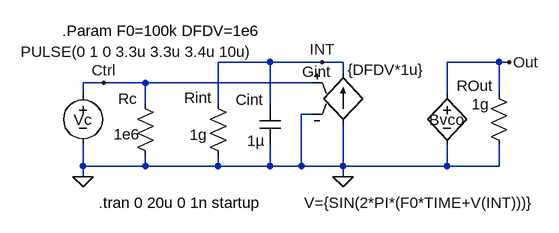
[diagram p0: schematic BehaVco.asc]
BehaVco.asc, the LTspice schematic file:
Version 4
SHEET 1 940 692
WIRE 16 176 16 160
WIRE 16 288 16 256
WIRE 16 304 16 288
WIRE 48 160 16 160
WIRE 112 160 48 160
WIRE 112 192 112 160
WIRE 112 288 16 288
WIRE 112 288 112 272
WIRE 224 192 224 128
WIRE 224 288 112 288
WIRE 224 288 224 272
WIRE 304 128 224 128
WIRE 304 192 304 128
WIRE 304 288 224 288
WIRE 304 288 304 256
WIRE 352 288 304 288
WIRE 352 288 352 208
WIRE 368 160 112 160
WIRE 368 208 352 208
WIRE 384 128 304 128
WIRE 416 128 384 128
WIRE 416 144 416 128
WIRE 416 288 352 288
WIRE 416 288 416 224
WIRE 416 304 416 288
WIRE 576 176 576 128
WIRE 576 288 416 288
WIRE 576 288 576 256
WIRE 656 128 576 128
WIRE 656 176 656 128
WIRE 656 288 576 288
WIRE 656 288 656 256
WIRE 672 128 656 128
FLAG 16 304 0
FLAG 416 304 0
FLAG 384 128 INT
FLAG 672 128 Out
FLAG 48 160 Ctrl
SYMBOL voltage 16 160 R0
WINDOW 0 -14 57 Left 0
WINDOW 3 262 -48 Right 0
WINDOW 123 0 0 Left 0
WINDOW 39 0 0 Left 0
SYMATTR InstName Vc
SYMATTR Value PULSE(0 1 0 3.3u 3.3u 3.4u 10u)
SYMBOL g 416 128 R0
WINDOW 0 -63 15 Left 0
WINDOW 3 7 12 Left 0
SYMATTR InstName Gint
SYMATTR Value {DFDV*1u}
SYMBOL res 96 176 R0
WINDOW 0 -26 8 Left 0
WINDOW 3 -33 63 Left 0
SYMATTR InstName Rc
SYMATTR Value 1e6
SYMBOL res 208 176 R0
WINDOW 0 -36 7 Left 0
WINDOW 3 -28 64 Left 0
SYMATTR InstName Rint
SYMATTR Value 1g
SYMBOL bv 576 160 R0
WINDOW 0 -27 57 Left 0
WINDOW 3 -220 184 Left 0
SYMATTR InstName Bvco
SYMATTR Value V={SIN(2*PI*(F0*TIME+V(INT)))}
SYMBOL cap 288 192 R0
WINDOW 3 -19 57 Left 0
WINDOW 0 -37 -6 Left 0
SYMATTR Value 1µ
SYMATTR InstName Cint
SYMBOL res 640 160 R0
WINDOW 0 -49 4 Left 0
WINDOW 3 -26 33 Left 0
SYMATTR InstName ROut
SYMATTR Value 1g
TEXT -16 80 Left 0 !.Param F0=100k DFDV=1e6
TEXT 40 344 Left 0 !.tran 0 20u 0 1n startup

The netlist it stands for:
* BehaVco.asc
Vc Ctrl 0 PULSE(0 1 0 3.3u 3.3u 3.4u 10u)
Gint 0 INT Ctrl 0 {DFDV*1u}
Rc Ctrl 0 1e6
Rint INT 0 1g
Bvco Out 0 V={SIN(2*PI*(F0*TIME+V(INT)))}
Cint INT 0 1µ
ROut Out 0 1g
.Param F0=100k DFDV=1e6
.tran 0 20u 0 1n startup
.backanno
.end